# Altium schematic sheet 用户输入.SchDoc
size A4
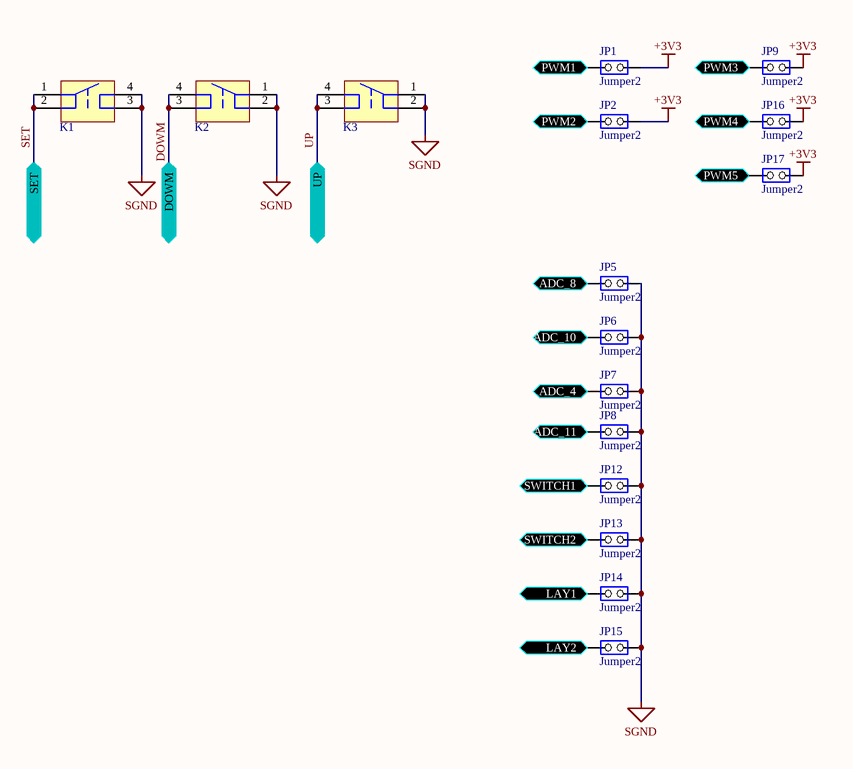
[diagram p0: 用户输入.SchDoc]

## Parts
JP1  Jumper2  [CON2-P2.54]
JP2  Jumper2  [CON2-P2.54]
JP5  Jumper2  [CON2-P2.54]
JP6  Jumper2  [CON2-P2.54]
JP7  Jumper2  [CON2-P2.54]
JP8  Jumper2  [CON2-P2.54]
JP9  Jumper2  [CON2-P2.54]
JP12  Jumper2  [CON2-P2.54]
JP13  Jumper2  [CON2-P2.54]
JP14  Jumper2  [CON2-P2.54]
JP15  Jumper2  [CON2-P2.54]
JP16  Jumper2  [CON2-P2.54]
JP17  Jumper2  [CON2-P2.54]
K1  12*12  [按键6*6贴片]  (value not drawn)
K2  12*12  [按键6*6贴片]  (value not drawn)
K3  12*12  [按键6*6贴片]  (value not drawn)

## Ports
ADC_4, ADC_8, ADC_10, ADC_11, DOWM, LAY1, LAY2, PWM1, PWM2, PWM3, PWM4, PWM5, SET, SWITCH1, SWITCH2, UP

## Nets
+3V3: JP1.2(NO) JP2.2(NO) JP9.2(NO) JP16.2(NO) JP17.2(NO)
SGND: JP5.2(NO) JP6.2(NO) JP7.2(NO) JP8.2(NO) JP12.2(NO) JP13.2(NO) JP14.2(NO) JP15.2(NO) K1.3 K1.4 K2.1 K2.2 K3.1 K3.2
ADC_4: JP7.1(COMMON) ; port ADC_4
ADC_8: JP5.1(COMMON) ; port ADC_8
ADC_10: JP6.1(COMMON) ; port ADC_10
ADC_11: JP8.1(COMMON) ; port ADC_11
DOWM: K2.3 K2.4 ; port DOWM
LAY1: JP14.1(COMMON) ; port LAY1
LAY2: JP15.1(COMMON) ; port LAY2
PWM1: JP1.1(COMMON) ; port PWM1
PWM2: JP2.1(COMMON) ; port PWM2
PWM3: JP9.1(COMMON) ; port PWM3
PWM4: JP16.1(COMMON) ; port PWM4
PWM5: JP17.1(COMMON) ; port PWM5
SET: K1.1 K1.2 ; port SET
SWITCH1: JP12.1(COMMON) ; port SWITCH1
SWITCH2: JP13.1(COMMON) ; port SWITCH2
UP: K3.3 K3.4 ; port UP

## Library data of the parts
K1-K3 = Button: 按键; Value: 12*12